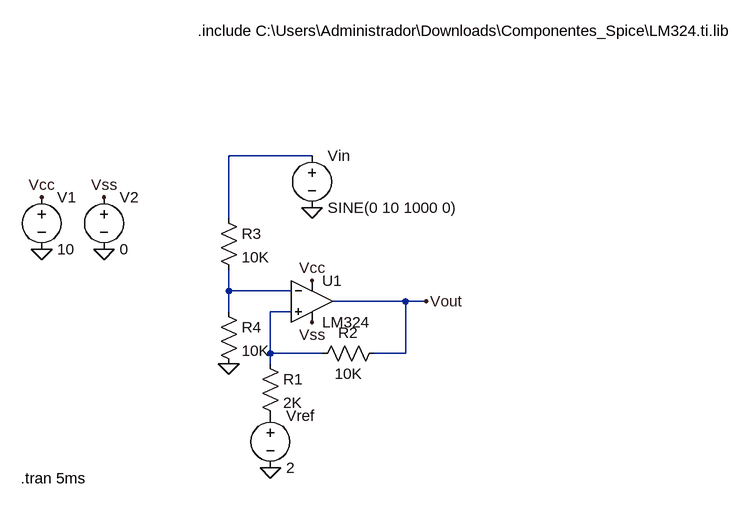
[diagram p0: schematic CompardorConHisteresis.asc]
CompardorConHisteresis.asc, the LTspice schematic file:
Version 4
SHEET 1 1008 680
WIRE 128 -48 0 -48
WIRE 0 48 0 -48
WIRE 0 160 0 128
WIRE 96 160 0 160
WIRE 272 176 160 176
WIRE 304 176 272 176
WIRE 0 192 0 160
WIRE 96 192 64 192
WIRE 64 256 64 192
WIRE 144 256 64 256
WIRE 272 256 272 176
WIRE 272 256 224 256
WIRE 64 272 64 256
FLAG 128 144 Vcc
FLAG -288 16 Vcc
FLAG -192 16 Vss
FLAG 128 208 Vss
FLAG 304 176 Vout
FLAG 0 272 0
FLAG 64 432 0
FLAG 128 32 0
FLAG -288 96 0
FLAG -192 96 0
SYMBOL OpAmps\\opamp2 128 112 R0
SYMATTR InstName U1
SYMATTR Value LM324
SYMBOL res 48 256 R0
SYMATTR InstName R1
SYMATTR Value 2K
SYMBOL res 240 240 R90
WINDOW 0 0 56 VBottom 2
WINDOW 3 32 56 VTop 2
SYMATTR InstName R2
SYMATTR Value 10K
SYMBOL res -16 32 R0
SYMATTR InstName R3
SYMATTR Value 10K
SYMBOL res -16 176 R0
SYMATTR InstName R4
SYMATTR Value 10K
SYMBOL voltage -288 0 R0
WINDOW 123 0 0 Left 0
WINDOW 39 0 0 Left 0
SYMATTR InstName V1
SYMATTR Value 10
SYMBOL voltage -192 0 R0
WINDOW 123 0 0 Left 0
WINDOW 39 0 0 Left 0
SYMATTR InstName V2
SYMATTR Value 0
SYMBOL voltage 128 -64 R0
WINDOW 123 0 0 Left 0
WINDOW 39 0 0 Left 0
SYMATTR InstName Vin
SYMATTR Value SINE(0 10 1000 0)
SYMBOL voltage 64 336 R0
WINDOW 123 0 0 Left 0
WINDOW 39 0 0 Left 0
SYMATTR InstName Vref
SYMATTR Value 2
TEXT -48 -240 Left 2 !.include C:\\Users\\Administrador\\Downloads\\Componentes_Spice\\LM324.ti.lib
TEXT -320 448 Left 2 !.tran 5ms

The netlist it stands for:
* CompardorConHisteresis.asc
XU1 N003 N002 Vcc Vss Vout LM324  ; pins In+ In- V+ V- OUT
R1 N003 P001 2K
R2 Vout N003 10K
R3 N001 N002 10K
R4 N002 0 10K
V1 Vcc 0 10
V2 Vss 0 0
Vin N001 0 SINE(0 10 1000 0)
Vref P001 0 2
.include C:\Users\Administrador\Downloads\Componentes_Spice\LM324.ti.lib
.tran 5ms
.backanno
.end